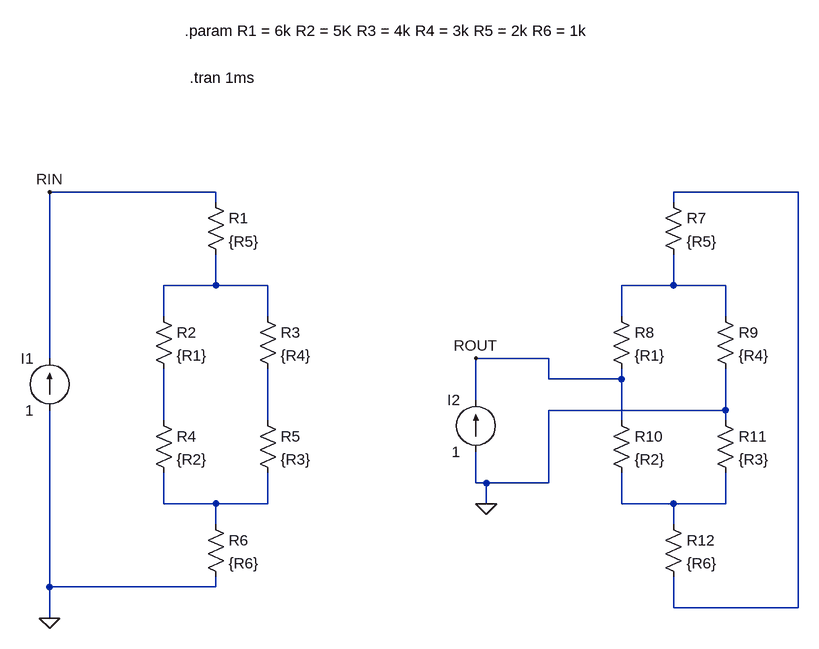
[diagram p0: schematic bridge_impedance.asc]
bridge_impedance.asc, the LTspice schematic file:
Version 4
SHEET 1 1076 680
WIRE 176 -48 -80 -48
WIRE 1072 -48 880 -48
WIRE 176 -32 176 -48
WIRE 880 -32 880 -48
WIRE 176 96 176 48
WIRE 176 96 96 96
WIRE 256 96 176 96
WIRE 880 96 880 48
WIRE 880 96 800 96
WIRE 960 96 880 96
WIRE 96 144 96 96
WIRE 256 144 256 96
WIRE 800 144 800 96
WIRE 960 144 960 96
WIRE -80 208 -80 -48
WIRE 688 208 576 208
WIRE 688 240 688 208
WIRE 800 240 800 224
WIRE 800 240 688 240
WIRE 576 272 576 208
WIRE 960 288 960 224
WIRE 960 288 688 288
WIRE 96 304 96 224
WIRE 256 304 256 224
WIRE 800 304 800 240
WIRE 960 304 960 288
WIRE 576 400 576 352
WIRE 592 400 576 400
WIRE 688 400 688 288
WIRE 688 400 592 400
WIRE 96 432 96 384
WIRE 176 432 96 432
WIRE 256 432 256 384
WIRE 256 432 176 432
WIRE 592 432 592 400
WIRE 800 432 800 384
WIRE 880 432 800 432
WIRE 960 432 960 384
WIRE 960 432 880 432
WIRE 176 464 176 432
WIRE 880 464 880 432
WIRE -80 560 -80 288
WIRE 176 560 176 544
WIRE 176 560 -80 560
WIRE 880 592 880 544
WIRE 1072 592 1072 -48
WIRE 1072 592 880 592
WIRE -80 608 -80 560
FLAG -80 608 0
FLAG -80 -48 RIN
FLAG 592 432 0
FLAG 576 208 ROUT
SYMBOL res 160 -48 R0
SYMATTR InstName R1
SYMATTR Value {R5}
SYMBOL res 80 128 R0
SYMATTR InstName R2
SYMATTR Value {R1}
SYMBOL res 240 128 R0
SYMATTR InstName R3
SYMATTR Value {R4}
SYMBOL res 80 288 R0
SYMATTR InstName R4
SYMATTR Value {R2}
SYMBOL res 240 288 R0
SYMATTR InstName R5
SYMATTR Value {R3}
SYMBOL res 160 448 R0
SYMATTR InstName R6
SYMATTR Value {R6}
SYMBOL current -80 288 R180
WINDOW 0 24 80 Left 2
WINDOW 3 24 0 Left 2
WINDOW 123 0 0 Left 0
WINDOW 39 0 0 Left 0
SYMATTR InstName I1
SYMATTR Value 1
SYMBOL res 864 -48 R0
SYMATTR InstName R7
SYMATTR Value {R5}
SYMBOL res 784 128 R0
SYMATTR InstName R8
SYMATTR Value {R1}
SYMBOL res 944 128 R0
SYMATTR InstName R9
SYMATTR Value {R4}
SYMBOL res 784 288 R0
SYMATTR InstName R10
SYMATTR Value {R2}
SYMBOL res 944 288 R0
SYMATTR InstName R11
SYMATTR Value {R3}
SYMBOL res 864 448 R0
SYMATTR InstName R12
SYMATTR Value {R6}
SYMBOL current 576 352 R180
WINDOW 0 24 80 Left 2
WINDOW 3 24 0 Left 2
WINDOW 123 0 0 Left 0
WINDOW 39 0 0 Left 0
SYMATTR InstName I2
SYMATTR Value 1
TEXT 128 -296 Left 2 !.param R1 = 6k R2 = 5K R3 = 4k R4 = 3k R5 = 2k R6 = 1k
TEXT 136 -224 Left 2 !.tran 1ms

The netlist it stands for:
* bridge_impedance.asc
R1 RIN N002 {R5}
R2 N002 N004 {R1}
R3 N002 N005 {R4}
R4 N004 N006 {R2}
R5 N005 N006 {R3}
R6 N006 0 {R6}
I1 0 RIN 1
R7 N001 N003 {R5}
R8 N003 ROUT {R1}
R9 N003 0 {R4}
R10 ROUT N007 {R2}
R11 0 N007 {R3}
R12 N007 N001 {R6}
I2 0 ROUT 1
.param R1 = 6k R2 = 5K R3 = 4k R4 = 3k R5 = 2k R6 = 1k
.tran 1ms
.backanno
.end